# Altium project V1_motor driver.PrjPCB
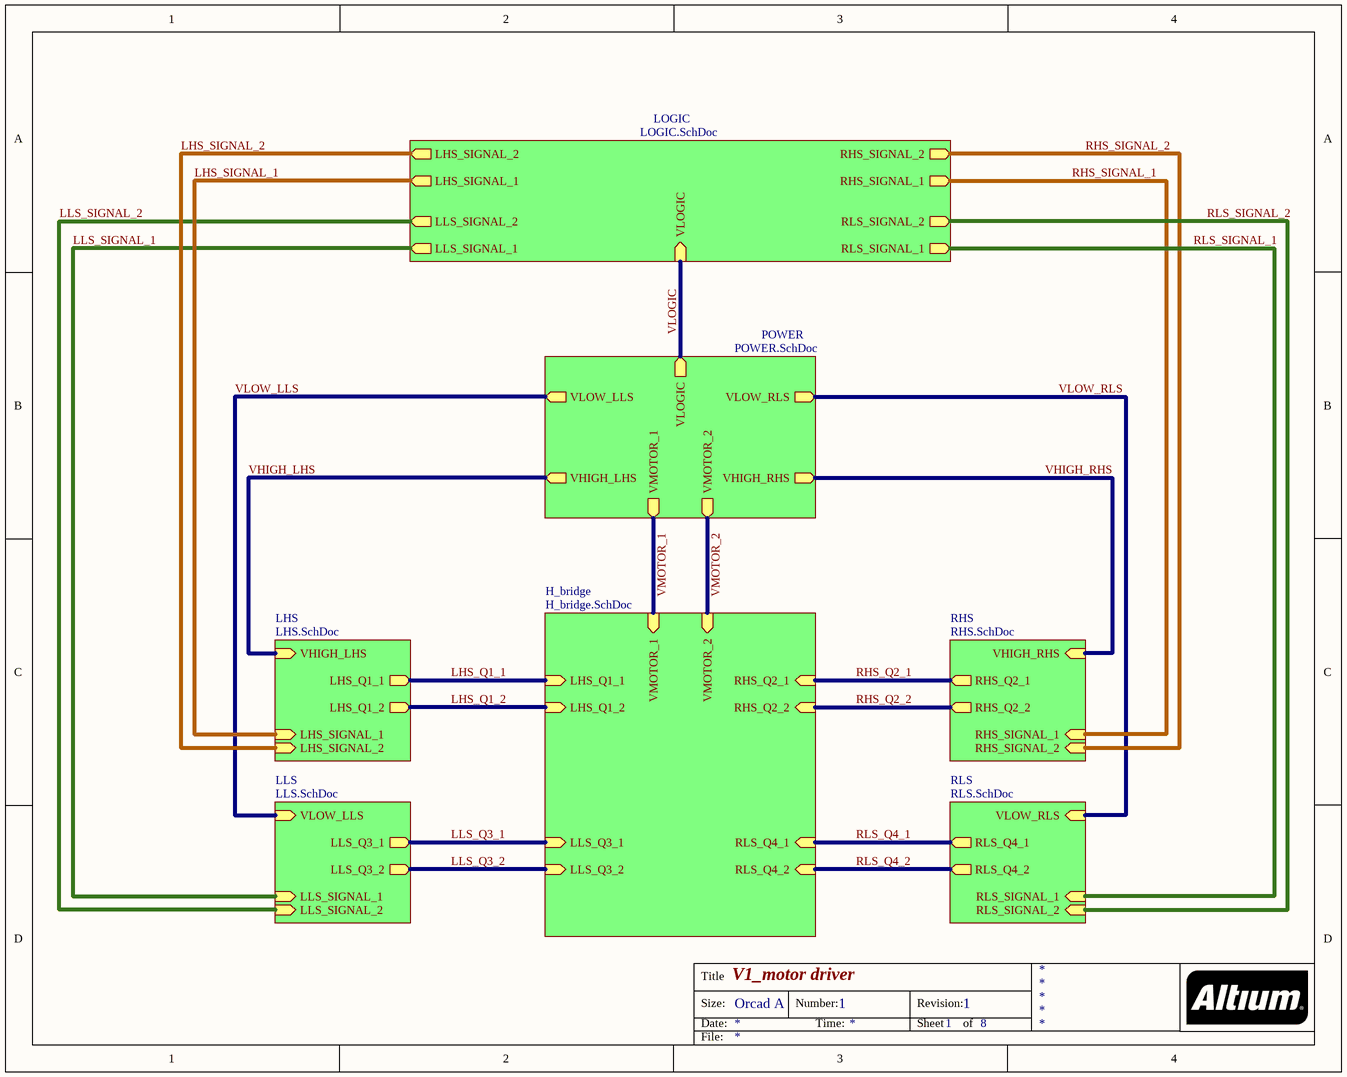
[diagram p0: Main_Sheet.SchDoc]
8 sheets, 120 parts. Net scope: hierarchical (ports join the sheet entries above them; power ports are global).
Board file: V1_motor driver.PcbDoc
Sheets:
  Main_Sheet.SchDoc
    H_bridge = H_bridge.SchDoc
    LHS = LHS.SchDoc
    LLS = LLS.SchDoc
    RHS = RHS.SchDoc
    RLS = RLS.SchDoc
    POWER = POWER.SchDoc
    LOGIC = LOGIC.SchDoc

## Sheet Main_Sheet.SchDoc: V1_motor driver
size OrCAD A; ApprovedBy: Abbas Mahmoud; CheckedBy: Abbas Mahmoud; Author: Abbas Mahmoud; CompanyName: lsa 4wya :); DrawnBy: Abbas Mahmoud; Engineer: Abbas Mahmoud; DocumentNumber: 1; Revision: 1; SheetNumber: 1; SheetTotal: 8

### Sub-sheets
H_bridge = H_bridge.SchDoc: VMOTOR_1 (in), LHS_Q1_1 (in), LLS_Q3_1 (in), RLS_Q4_1 (in), RHS_Q2_1 (in), RHS_Q2_2 (in), RLS_Q4_2 (in), LLS_Q3_2 (in), LHS_Q1_2 (in), VMOTOR_2 (in)
LHS = LHS.SchDoc: LHS_Q1_1 (out), VHIGH_LHS (in), LHS_SIGNAL_1 (in), LHS_Q1_2 (out), LHS_SIGNAL_2 (in)
LLS = LLS.SchDoc: LLS_Q3_1 (out), VLOW_LLS (in), LLS_SIGNAL_1 (in), LLS_Q3_2 (out), LLS_SIGNAL_2 (in)
LOGIC = LOGIC.SchDoc: VLOGIC (in), RHS_SIGNAL_1 (out), RHS_SIGNAL_2 (out), RLS_SIGNAL_1 (out), RLS_SIGNAL_2 (out), LHS_SIGNAL_1 (out), LHS_SIGNAL_2 (out), LLS_SIGNAL_1 (out), LLS_SIGNAL_2 (out)
POWER = POWER.SchDoc: VMOTOR_1 (out), VHIGH_LHS (out), VLOW_LLS (out), VHIGH_RHS (out), VLOW_RLS (out), VLOGIC (out), VMOTOR_2 (out)
RHS = RHS.SchDoc: RHS_Q2_1 (out), RHS_SIGNAL_1 (in), VHIGH_RHS (in), RHS_Q2_2 (out), RHS_SIGNAL_2 (in)
RLS = RLS.SchDoc: RLS_Q4_1 (out), RLS_SIGNAL_1 (in), VLOW_RLS (in), RLS_Q4_2 (out), RLS_SIGNAL_2 (in)

### Nets
VHIGH_LHS: sheet LHS/VHIGH_LHS, sheet RHS/VHIGH_RHS, sheet POWER/VHIGH_LHS, sheet POWER/VHIGH_RHS  [also labelled VHIGH_RHS]
VLOGIC: sheet POWER/VLOGIC, sheet LOGIC/VLOGIC
VLOW_LLS: sheet LLS/VLOW_LLS, sheet RLS/VLOW_RLS, sheet POWER/VLOW_LLS, sheet POWER/VLOW_RLS  [also labelled VLOW_RLS]
VMOTOR_1: sheet H_bridge/VMOTOR_1, sheet H_bridge/VMOTOR_2, sheet POWER/VMOTOR_1, sheet POWER/VMOTOR_2  [also labelled VMOTOR_2]
LHS_Q1_1: sheet H_bridge/LHS_Q1_1, sheet LHS/LHS_Q1_1
LHS_Q1_2: sheet H_bridge/LHS_Q1_2, sheet LHS/LHS_Q1_2
LHS_SIGNAL_1: sheet LHS/LHS_SIGNAL_1, sheet RLS/RLS_SIGNAL_1, sheet LOGIC/RLS_SIGNAL_1, sheet LOGIC/LHS_SIGNAL_1  [also labelled RLS_SIGNAL_1]  [project net A_D2]
LHS_SIGNAL_2: sheet LHS/LHS_SIGNAL_2, sheet RLS/RLS_SIGNAL_2, sheet LOGIC/RLS_SIGNAL_2, sheet LOGIC/LHS_SIGNAL_2  [also labelled RLS_SIGNAL_2]  [project net B_D2]
LLS_Q3_1: sheet H_bridge/LLS_Q3_1, sheet LLS/LLS_Q3_1
LLS_Q3_2: sheet H_bridge/LLS_Q3_2, sheet LLS/LLS_Q3_2
LLS_SIGNAL_1: sheet LLS/LLS_SIGNAL_1, sheet RHS/RHS_SIGNAL_1, sheet LOGIC/RHS_SIGNAL_1, sheet LOGIC/LLS_SIGNAL_1  [also labelled RHS_SIGNAL_1]  [project net A_D1]
LLS_SIGNAL_2: sheet LLS/LLS_SIGNAL_2, sheet RHS/RHS_SIGNAL_2, sheet LOGIC/RHS_SIGNAL_2, sheet LOGIC/LLS_SIGNAL_2  [also labelled RHS_SIGNAL_2]  [project net B_D1]
RHS_Q2_1: sheet H_bridge/RHS_Q2_1, sheet RHS/RHS_Q2_1
RHS_Q2_2: sheet H_bridge/RHS_Q2_2, sheet RHS/RHS_Q2_2
RLS_Q4_1: sheet H_bridge/RLS_Q4_1, sheet RLS/RLS_Q4_1
RLS_Q4_2: sheet H_bridge/RLS_Q4_2, sheet RLS/RLS_Q4_2

### Notes on the sheet
- Title
- Size:
- Date:
- Orcad A
- Number:
- Time:
- Revision:
- Sheet
- of
- File:

## Sheet H_bridge.SchDoc: H_bridge
size OrCAD A; ApprovedBy: Abbsa Mahmoud; CheckedBy: Abbas mahmoud; Author: Abbas Mahmoud; CompanyName: lsa 4wya :); DrawnBy: Abbas Mahmoud; Engineer: Abbas Mahmoud; DocumentNumber: 2; SheetNumber: 2; SheetTotal: 8
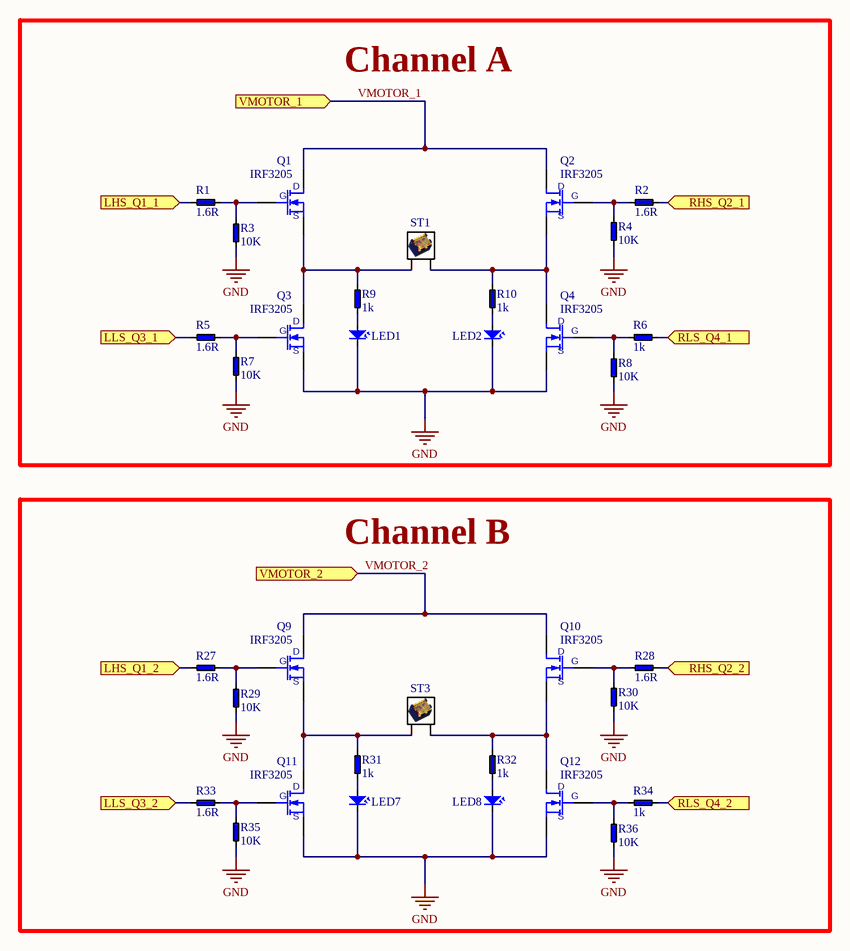
[diagram p1: H_bridge.SchDoc]

### Parts
LED1  LED  [LED 3MM BLUE]  (value not drawn)
LED2  LED  [LED 3MM BLUE]  (value not drawn)
LED7  LED  [LED 3MM BLUE]  (value not drawn)
LED8  LED  [LED 3MM BLUE]  (value not drawn)
Q1  IRF3205  [Transistor - duplicate2]
Q2  IRF3205  [Transistor - duplicate2]
Q3  IRF3205  [Transistor - duplicate2]
Q4  IRF3205  [Transistor - duplicate2]
Q9  IRF3205  [Transistor - duplicate2]
Q10  IRF3205  [Transistor - duplicate2]
Q11  IRF3205  [Transistor - duplicate2]
Q12  IRF3205  [Transistor - duplicate2]
R1  1.6R  [RESISTOR _9]
R2  1.6R  [RESISTOR _9]
R3  10K  [RESISTOR _9]
R4  10K  [RESISTOR _9]
R5  1.6R  [RESISTOR _9]
R6  1k  [RESISTOR _9]
R7  10K  [RESISTOR _9]
R8  10K  [RESISTOR _9]
R9  1k  [RESISTOR _9]
R10  1k  [RESISTOR _9]
R27  1.6R  [RESISTOR _9]
R28  1.6R  [RESISTOR _9]
R29  10K  [RESISTOR _9]
R30  10K  [RESISTOR _9]
R31  1k  [RESISTOR _9]
R32  1k  [RESISTOR _9]
R33  1.6R  [RESISTOR _9]
R34  1k  [RESISTOR _9]
R35  10K  [RESISTOR _9]
R36  10K  [RESISTOR _9]
ST1  SCREW TERMINAL  [SCREW TERMINAL]  (value not drawn)
ST3  SCREW TERMINAL  [SCREW TERMINAL]  (value not drawn)

### Blocks framed on the sheet
Channel A: LED1 LED2 Q1-Q4 R1-R10 ST1
Channel B: LED7 LED8 Q9-Q12 R27-R36 ST3

### Ports
LHS_Q1_1 (in), LHS_Q1_2 (in), LLS_Q3_1 (in), LLS_Q3_2 (in), RHS_Q2_1 (in), RHS_Q2_2 (in), RLS_Q4_1 (in), RLS_Q4_2 (in), VMOTOR_1 (in), VMOTOR_2 (in)

### Nets
GND: LED1.K LED2.K LED7.K LED8.K Q3.3(S) Q4.3(S) Q11.3(S) Q12.3(S) R3.1 R4.1 R7.1 R8.1 R29.1 R30.1 R35.1 R36.1
VMOTOR_1: Q1.2(D) Q2.2(D) Q9.2(D) Q10.2(D) ; port VMOTOR_1, port VMOTOR_2  [also labelled VMOTOR_2]
LHS_Q1_1: R1.1 ; port LHS_Q1_1
LHS_Q1_2: R27.1 ; port LHS_Q1_2
LLS_Q3_1: R5.1 ; port LLS_Q3_1
LLS_Q3_2: R33.1 ; port LLS_Q3_2
RHS_Q2_1: R2.2 ; port RHS_Q2_1
RHS_Q2_2: R28.2 ; port RHS_Q2_2
RLS_Q4_1: R6.2 ; port RLS_Q4_1
RLS_Q4_2: R34.2 ; port RLS_Q4_2
NetLED1_A: LED1.A R9.1
NetLED2_A: LED2.A R10.1
NetLED7_A: LED7.A R31.1
NetLED8_A: LED8.A R32.1
NetQ1_1: Q1.1(G) R1.2 R3.2
NetQ1_3: Q1.3(S) Q3.2(D) R9.2 ST1.1(AC)
NetQ2_1: Q2.1(G) R2.1 R4.2
NetQ2_3: Q2.3(S) Q4.2(D) R10.2 ST1.2(AC)
NetQ3_1: Q3.1(G) R5.2 R7.2
NetQ4_1: Q4.1(G) R6.1 R8.2
NetQ9_1: Q9.1(G) R27.2 R29.2
NetQ9_3: Q9.3(S) Q11.2(D) R31.2 ST3.1(AC)
NetQ10_1: Q10.1(G) R28.1 R30.2
NetQ10_3: Q10.3(S) Q12.2(D) R32.2 ST3.2(AC)
NetQ11_1: Q11.1(G) R33.2 R35.2
NetQ12_1: Q12.1(G) R34.1 R36.2

### Notes on the sheet
- Title
- Size:
- Date:
- Orcad A
- Number:
- Time:
- Revision:
- Sheet
- of
- File:

### Library data of the parts
Q1-Q4 Q9-Q12 = MOSFET-N: N CHANNEL MOSFET
R1-R10 R27-R36 = RESISTOR
ST1 ST3 = SCREW TERMINAL: Barrier Terminal Block 2 Pin with cover 300V/25A

## Sheet LHS.SchDoc: LHS
size OrCAD A; ApprovedBy: Abbas Mahmoud; CheckedBy: Abbas Mahmoud; Author: Abbas Mahmoud; CompanyName: lsa 4wya :); DrawnBy: Abbas Mahmoud; Engineer: Abbas Mahmoud; DocumentNumber: 7; Revision: 1; SheetNumber: 7; SheetTotal: 8
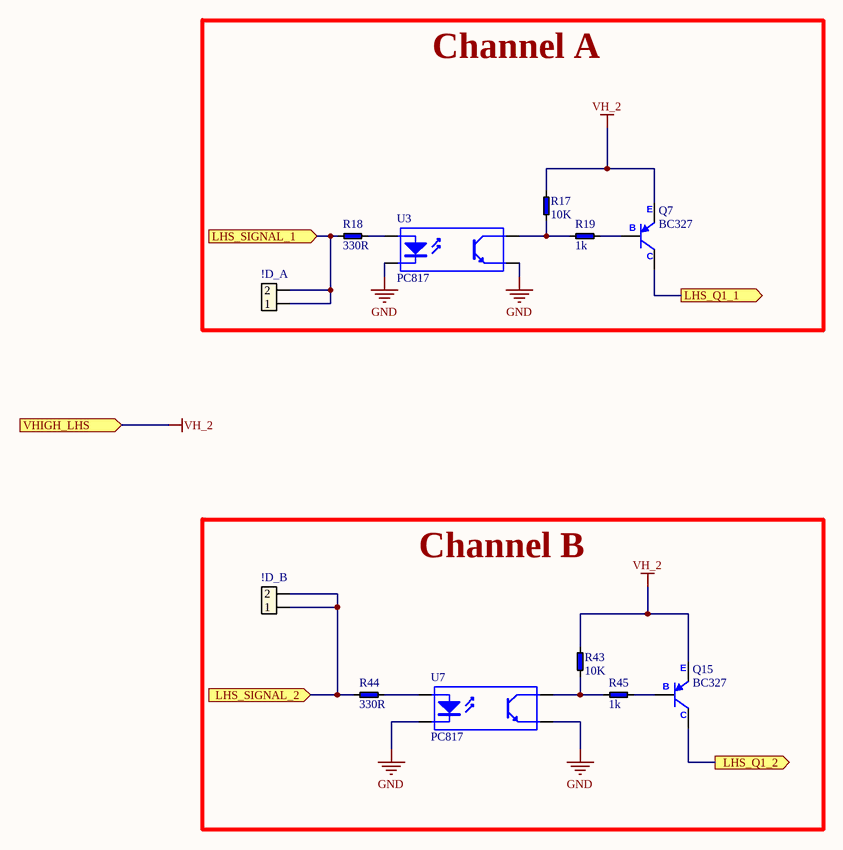
[diagram p2: LHS.SchDoc]

### Parts
!D_A  Header 2  [PINHEADER X2]  (value not drawn)
!D_B  Header 2  [PINHEADER X2]  (value not drawn)
Q7  BC327  [Transistor - duplicate3]
Q15  BC327  [Transistor - duplicate3]
R17  10K  [RESISTOR _9]
R18  330R  [RESISTOR _9]
R19  1k  [RESISTOR _9]
R43  10K  [RESISTOR _9]
R44  330R  [RESISTOR _9]
R45  1k  [RESISTOR _9]
U3  PC817  [IC X4 PIN]
U7  PC817  [IC X4 PIN]

### Blocks framed on the sheet
Channel A: !D_A Q7 R17-R19 U3
Channel B: !D_B Q15 R43-R45 U7

### Ports
LHS_Q1_1 (out), LHS_Q1_2 (out), LHS_SIGNAL_1 (in), LHS_SIGNAL_2 (in), VHIGH_LHS (in)

### Nets
GND: U3.2(K) U3.3(E) U7.2(K) U7.3(E)
VH_2: Q7.1(E) Q15.1(E) R17.1 R43.2 ; port VHIGH_LHS  [project net VHIGH_LHS]
A_D2: !D_A.1 !D_A.2 R18.1 ; port LHS_SIGNAL_1
B_D2: !D_B.1 !D_B.2 R44.1 ; port LHS_SIGNAL_2
LHS_Q1_1: Q7.3(C) ; port LHS_Q1_1
LHS_Q1_2: Q15.3(C) ; port LHS_Q1_2
NetQ7_2: Q7.2(B) R19.2
NetQ15_2: Q15.2(B) R45.2
NetR17_2: R17.2 R19.1 U3.4(C)
NetR18_2: R18.2 U3.1(A)
NetR43_1: R43.1 R45.1 U7.4(C)
NetR44_2: R44.2 U7.1(A)

### Notes on the sheet
- Title
- Size:
- Date:
- Orcad A
- Number:
- Time:
- Revision:
- Sheet
- of
- File:

### Library data of the parts
!D_A !D_B = Header 2: Header, 2-Pin; LatestRevisionDate: 17-Jul-2002; LatestRevisionNote: Re-released for DXP Platform.; Publisher: Altium Limited
Q7 Q15 = PNP
R17-R19 R43-R45 = RESISTOR
U3 U7 = Opto-coupler: 4-Pin Phototransistor Optocoupler; Published: 24-Mar-1999; LatestRevisionDate: 04-Mar-2005; LatestRevisionNote: Sch pins 3 & 4 Swapped.; DatasheetVersion: Nov-2003; PackageReference: DIP-4; Publisher: Altium Limited

## Sheet LLS.SchDoc: LLS
size OrCAD A; ApprovedBy: Abbas Mahmoud; CheckedBy: Abbas Mahmoud; Author: Abbas Mahmoud; CompanyName: lsa 4wya :); DrawnBy: Abbas Mahmoud; Engineer: Abbas Mahmoud; DocumentNumber: 8; Revision: 1; SheetNumber: 8; SheetTotal: 8
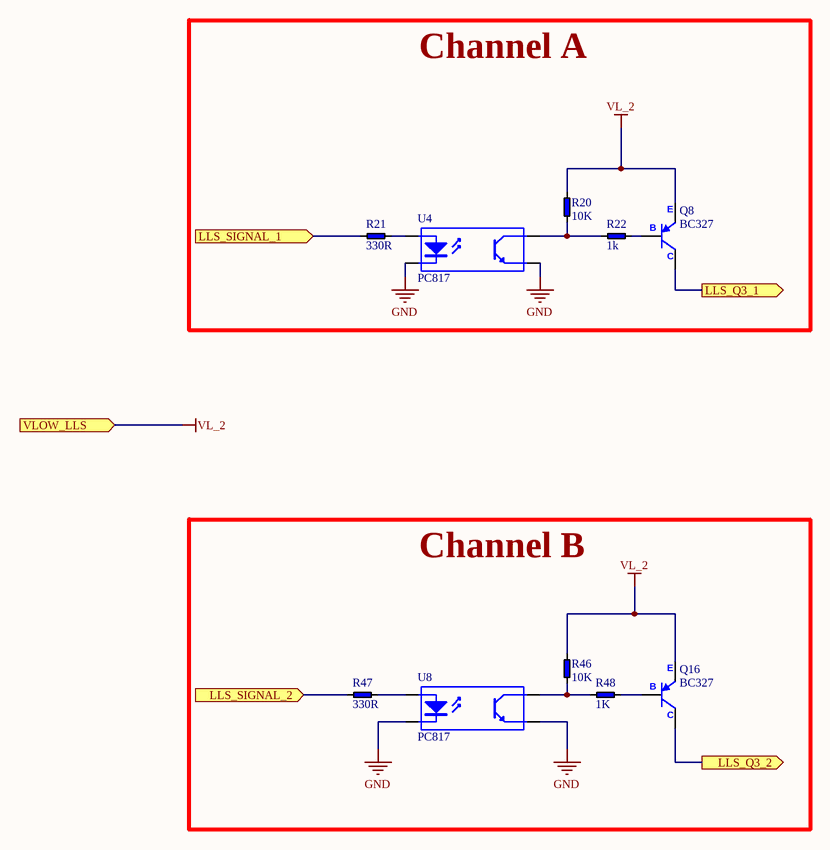
[diagram p3: LLS.SchDoc]

### Parts
Q8  BC327  [Transistor - duplicate3]
Q16  BC327  [Transistor - duplicate3]
R20  10K  [RESISTOR _9]
R21  330R  [RESISTOR _9]
R22  1k  [RESISTOR _9]
R46  10K  [RESISTOR _9]
R47  330R  [RESISTOR _9]
R48  1K  [RESISTOR _9]
U4  PC817  [IC X4 PIN]
U8  PC817  [IC X4 PIN]

### Blocks framed on the sheet
Channel A: Q8 R20-R22 U4
Channel B: Q16 R46-R48 U8

### Ports
LLS_Q3_1 (out), LLS_Q3_2 (out), LLS_SIGNAL_1 (in), LLS_SIGNAL_2 (in), VLOW_LLS (in)

### Nets
GND: U4.2(K) U4.3(E) U8.2(K) U8.3(E)
VL_2: Q8.1(E) Q16.1(E) R20.2 R46.2 ; port VLOW_LLS  [project net VLOW_LLS]
A_D1: R21.1 ; port LLS_SIGNAL_1
B_D1: R47.1 ; port LLS_SIGNAL_2
LLS_Q3_1: Q8.3(C) ; port LLS_Q3_1
LLS_Q3_2: Q16.3(C) ; port LLS_Q3_2
NetQ8_2: Q8.2(B) R22.2
NetQ16_2: Q16.2(B) R48.2
NetR20_1: R20.1 R22.1 U4.4(C)
NetR21_2: R21.2 U4.1(A)
NetR46_1: R46.1 R48.1 U8.4(C)
NetR47_2: R47.2 U8.1(A)

### Notes on the sheet
- Title
- Size:
- Date:
- Orcad A
- Number:
- Time:
- Revision:
- Sheet
- of
- File:

### Library data of the parts
Q8 Q16 = PNP
R20-R22 R46-R48 = RESISTOR
U4 U8 = Opto-coupler: 4-Pin Phototransistor Optocoupler; Published: 24-Mar-1999; LatestRevisionDate: 04-Mar-2005; LatestRevisionNote: Sch pins 3 & 4 Swapped.; DatasheetVersion: Nov-2003; PackageReference: DIP-4; Publisher: Altium Limited

## Sheet RHS.SchDoc: RHS
size OrCAD A; ApprovedBy: Abbas Mahmoud; CheckedBy: Abbas Mahmoud; Author: Abbas Mahmoud; CompanyName: lsa 4wya :); DrawnBy: Abbas Mahmoud; Engineer: Abbas Mahmoud; DocumentNumber: 5; Revision: 1; SheetNumber: 5; SheetTotal: 8
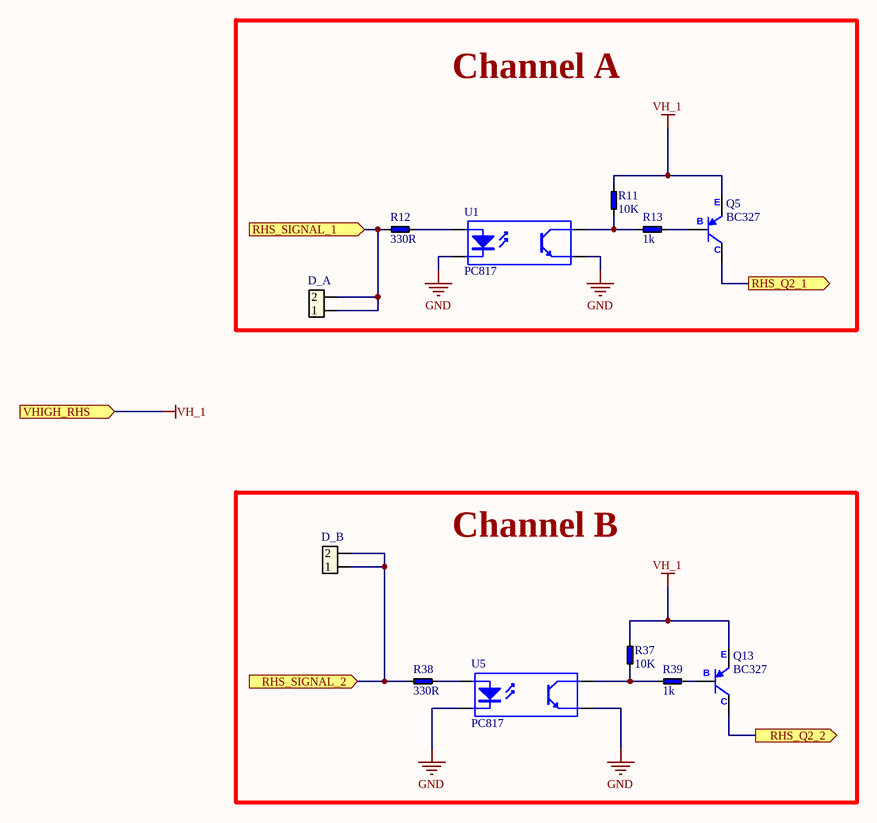
[diagram p4: RHS.SchDoc]

### Parts
D_A  Header 2  [PINHEADER X2]  (value not drawn)
D_B  Header 2  [PINHEADER X2]  (value not drawn)
Q5  BC327  [Transistor - duplicate3]
Q13  BC327  [Transistor - duplicate3]
R11  10K  [RESISTOR _9]
R12  330R  [RESISTOR _9]
R13  1k  [RESISTOR _9]
R37  10K  [RESISTOR _9]
R38  330R  [RESISTOR _9]
R39  1k  [RESISTOR _9]
U1  PC817  [IC X4 PIN]
U5  PC817  [IC X4 PIN]

### Blocks framed on the sheet
Channel A: D_A Q5 R11-R13 U1
Channel B: D_B Q13 R37-R39 U5

### Ports
RHS_Q2_1 (out), RHS_Q2_2 (out), RHS_SIGNAL_1 (in), RHS_SIGNAL_2 (in), VHIGH_RHS (in)

### Nets
GND: U1.2(K) U1.3(E) U5.2(K) U5.3(E)
VH_1: Q5.1(E) Q13.1(E) R11.2 R37.2 ; port VHIGH_RHS  [project net VHIGH_LHS]
A_D1: D_A.1 D_A.2 R12.1 ; port RHS_SIGNAL_1
B_D1: D_B.1 D_B.2 R38.1 ; port RHS_SIGNAL_2
RHS_Q2_1: Q5.3(C) ; port RHS_Q2_1
RHS_Q2_2: Q13.3(C) ; port RHS_Q2_2
NetQ5_2: Q5.2(B) R13.2
NetQ13_2: Q13.2(B) R39.2
NetR11_1: R11.1 R13.1 U1.4(C)
NetR12_2: R12.2 U1.1(A)
NetR37_1: R37.1 R39.1 U5.4(C)
NetR38_2: R38.2 U5.1(A)

### Notes on the sheet
- Title
- Size:
- Date:
- Orcad A
- Number:
- Time:
- Revision:
- Sheet
- of
- File:

### Library data of the parts
D_A D_B = Header 2: Header, 2-Pin; LatestRevisionDate: 17-Jul-2002; LatestRevisionNote: Re-released for DXP Platform.; Publisher: Altium Limited
Q5 Q13 = PNP
R11-R13 R37-R39 = RESISTOR
U1 U5 = Opto-coupler: 4-Pin Phototransistor Optocoupler; Published: 24-Mar-1999; LatestRevisionDate: 04-Mar-2005; LatestRevisionNote: Sch pins 3 & 4 Swapped.; DatasheetVersion: Nov-2003; PackageReference: DIP-4; Publisher: Altium Limited

## Sheet RLS.SchDoc: RLS
size OrCAD A; ApprovedBy: Abbas Mahmoud; CheckedBy: Abbas Mahmoud; Author: Abbas Mahmoud; CompanyName: lsa 4wya :); DrawnBy: Abbas Mahmoud; Engineer: Abbas Mahmoud; DocumentNumber: 6; Revision: 1; SheetNumber: 6; SheetTotal: 8
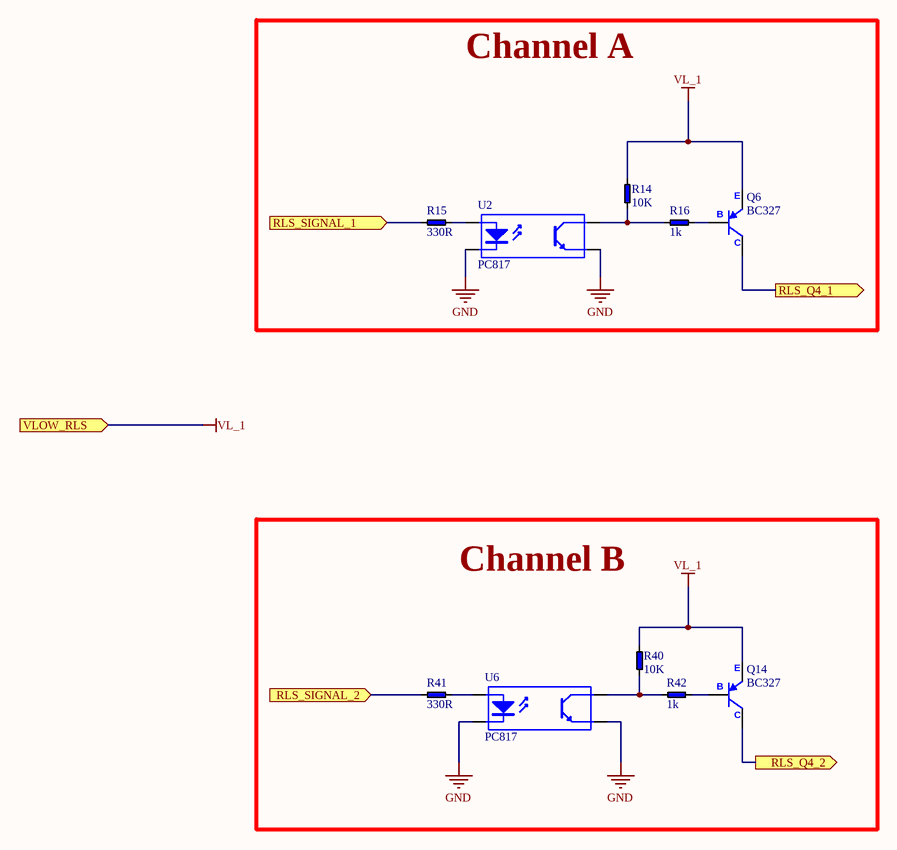
[diagram p5: RLS.SchDoc]

### Parts
Q6  BC327  [Transistor - duplicate3]
Q14  BC327  [Transistor - duplicate3]
R14  10K  [RESISTOR _9]
R15  330R  [RESISTOR _9]
R16  1k  [RESISTOR _9]
R40  10K  [RESISTOR _9]
R41  330R  [RESISTOR _9]
R42  1k  [RESISTOR _9]
U2  PC817  [IC X4 PIN]
U6  PC817  [IC X4 PIN]

### Blocks framed on the sheet
Channel A: Q6 R14-R16 U2
Channel B: Q14 R40-R42 U6

### Ports
RLS_Q4_1 (out), RLS_Q4_2 (out), RLS_SIGNAL_1 (in), RLS_SIGNAL_2 (in), VLOW_RLS (in)

### Nets
GND: U2.2(K) U2.3(E) U6.2(K) U6.3(E)
VL_1: Q6.1(E) Q14.1(E) R14.2 R40.2 ; port VLOW_RLS  [project net VLOW_LLS]
A_D2: R15.1 ; port RLS_SIGNAL_1
B_D2: R41.1 ; port RLS_SIGNAL_2
RLS_Q4_1: Q6.3(C) ; port RLS_Q4_1
RLS_Q4_2: Q14.3(C) ; port RLS_Q4_2
NetQ6_2: Q6.2(B) R16.2
NetQ14_2: Q14.2(B) R42.2
NetR14_1: R14.1 R16.1 U2.4(C)
NetR15_2: R15.2 U2.1(A)
NetR40_1: R40.1 R42.1 U6.4(C)
NetR41_2: R41.2 U6.1(A)

### Notes on the sheet
- Title
- Size:
- Date:
- Orcad A
- Number:
- Time:
- Revision:
- Sheet
- of
- File:

### Library data of the parts
Q6 Q14 = PNP
R14-R16 R40-R42 = RESISTOR
U2 U6 = Opto-coupler: 4-Pin Phototransistor Optocoupler; Published: 24-Mar-1999; LatestRevisionDate: 04-Mar-2005; LatestRevisionNote: Sch pins 3 & 4 Swapped.; DatasheetVersion: Nov-2003; PackageReference: DIP-4; Publisher: Altium Limited

## Sheet POWER.SchDoc: POWER
size A; ApprovedBy: Abbas Mahmoud; CheckedBy: Abbas Mahmoud; Author: Abbas Mahmoud; CompanyName: lsa 4wya :); DrawnBy: Abbas Mahmoud; Engineer: Abbas Mahmoud; DocumentNumber: 3; Revision: 1; SheetNumber: 3; SheetTotal: 8
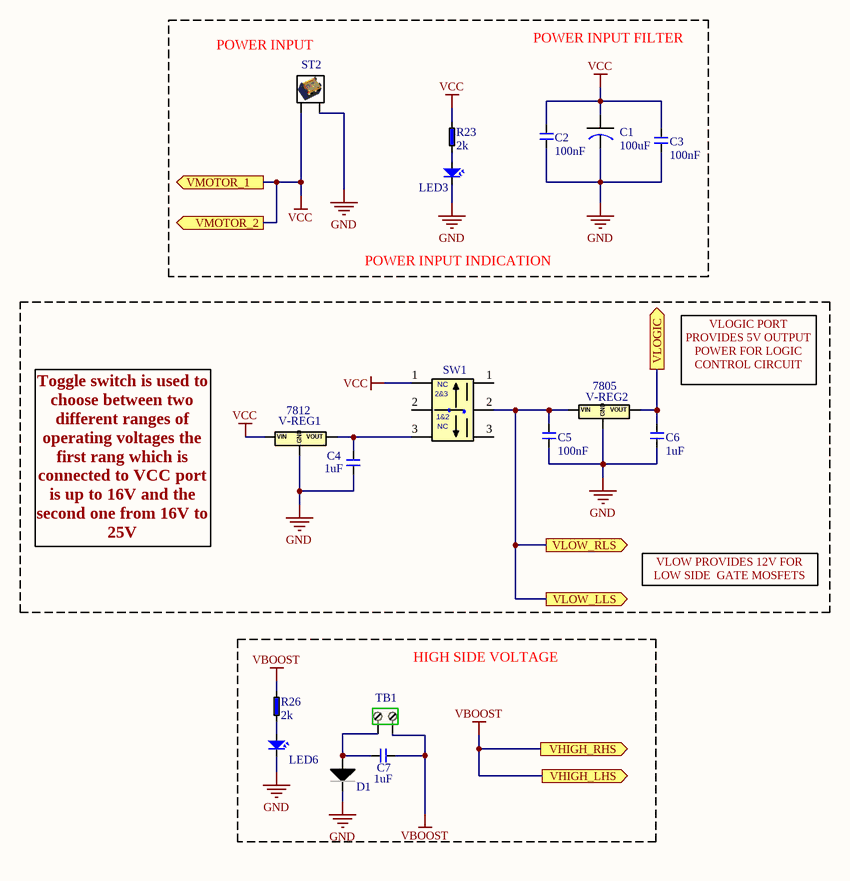
[diagram p6: POWER.SchDoc]

### Parts
C1  100uF  [ECAP 5X11X2MM]
C2  100nF  [CCAP 0.1 N Y]
C3  100nF  [CCAP 0.1 N Y]
C4  1uF  [CCAP 0.1 N Y]
C5  100nF  [CCAP 0.1 N Y]
C6  1uF  [CCAP 0.1 N Y]
C7  1uF  [CCAP 0.1 N Y]
D1  DIODE  [DIODE SMD]  (value not drawn)
LED3  LED  [LED 3MM GREEN]  (value not drawn)
LED6  LED  [LED 5MM GREEN]  (value not drawn)
R23  2k  [RESISTOR _9]
R26  2k  [RESISTOR _9]
ST2  SCREW TERMINAL  [SCREW TERMINAL]  (value not drawn)
SW1  Toggle Switch  [Toggle 3 pins]  (value not drawn)
TB1  Terminal block 2 pin  [AK500/2 - pluggable]  (value not drawn)
V-REG1  7812  [V-REG]
V-REG2  7805  [V-REG]

### Blocks framed on the sheet
HIGH SIDE VOLTAGE: C7 D1 LED6 R26 TB1

### Ports
VHIGH_LHS (out), VHIGH_RHS (out), VLOGIC (out), VLOW_LLS (out), VLOW_RLS (out), VMOTOR_1 (out), VMOTOR_2 (out)

### Nets
GND: C1.K C2.2 C3.2 C4.2 C5.2 C6.2 D1.K LED3.K LED6.K ST2.2(AC) V-REG1.2(GND) V-REG2.2(GND)
VBOOST: C7.2 R26.2 TB1.1 ; port VHIGH_RHS, port VHIGH_LHS  [project net VHIGH_LHS]
VCC: C1.A C2.1 C3.1 R23.2 ST2.1(AC) SW1.1 V-REG1.1(VIN) ; port VMOTOR_1, port VMOTOR_2  [project net VMOTOR_1]
VLOGIC: C6.1 V-REG2.3(VOUT) ; port VLOGIC
VLOW_LLS: C5.1 SW1.2 V-REG2.1(VIN) ; port VLOW_RLS, port VLOW_LLS
NetC4_1: C4.1 SW1.3 V-REG1.3(VOUT)
NetC7_1: C7.1 D1.A TB1.2
NetLED3_A: LED3.A R23.1
NetLED6_A: LED6.A R26.1

### Notes on the sheet
- (near ST2) POWER INPUT
- POWER INPUT FILTER
- POWER INPUT INDICATION
- VLOGIC PORT PROVIDES 5V OUTPUT POWER FOR LOGIC CONTROL CIRCUIT
- Toggle switch is used to choose between two different ranges of operating voltages the first rang which is connected to VCC port is up to 16V and the second one from 16V to 25V
- VLOW PROVIDES 12V FOR LOW SIDE  GATE MOSFETS
- Title
- Size:
- Date:
- A
- Number:
- Time:
- Revision:
- Sheet
- of
- File:
- (in symbol Toggle Switch) NC; 2&3; 1&2

### Library data of the parts
C1 = CAP POL
C2-C7 = CERAMIC CAP
R23 R26 = RESISTOR
ST2 = SCREW TERMINAL: as ST1 on sheet H_bridge
SW1 = Toggle Switch: Toggle Switch 3-Pin SPDT ON-ON 6A 125VAC
TB1 = Terminal block 2 pin: Terminal Block 2 Pin 10A 300V
V-REG1 V-REG2 = V-REG: 78xx Regulators

## Sheet LOGIC.SchDoc: LOGIC
size OrCAD A; ApprovedBy: Abbas Mahmoud; CheckedBy: Abbas Mahmoud; Author: Abbas Mahmoud; CompanyName: lsa 4wya :); DrawnBy: Abbas Mahmoud; Engineer: Abbas Mahmoud; DocumentNumber: 4; Revision: 1; SheetNumber: 4; SheetTotal: 8
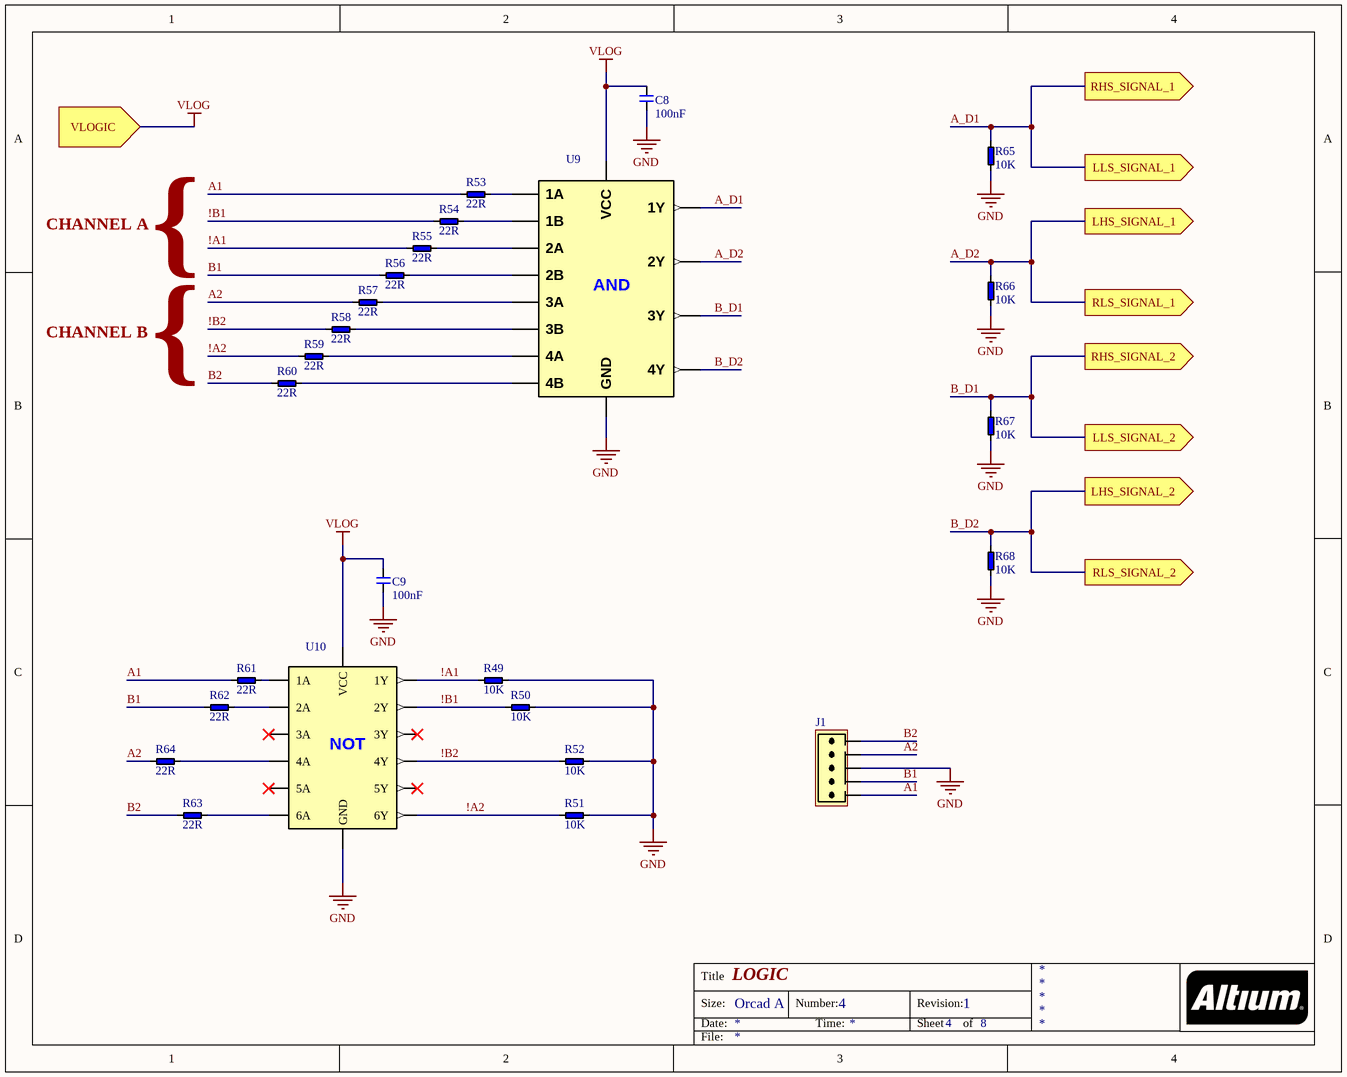
[diagram p7: LOGIC.SchDoc]

### Parts
C8  100nF  [CCAP 0.1 N Y]
C9  100nF  [CCAP 0.1 N Y]
J1  DATA CONNECTOR *5  [MOLEX *5_DATA CONNECTOR]  (value not drawn)
R49  10K  [RESISTOR _9]
R50  10K  [RESISTOR _9]
R51  10K  [RESISTOR _9]
R52  10K  [RESISTOR _9]
R53  22R  [RESISTOR _9]
R54  22R  [RESISTOR _9]
R55  22R  [RESISTOR _9]
R56  22R  [RESISTOR _9]
R57  22R  [RESISTOR _9]
R58  22R  [RESISTOR _9]
R59  22R  [RESISTOR _9]
R60  22R  [RESISTOR _9]
R61  22R  [RESISTOR _9]
R62  22R  [RESISTOR _9]
R63  22R  [RESISTOR _9]
R64  22R  [RESISTOR _9]
R65  10K  [RESISTOR _9]
R66  10K  [RESISTOR _9]
R67  10K  [RESISTOR _9]
R68  10K  [RESISTOR _9]
U9  SN74F08N  [IC X14 PIN]  (value not drawn)
U10  SN7404N  [IC X14 PIN]  (value not drawn)

### Ports
LHS_SIGNAL_1 (out), LHS_SIGNAL_2 (out), LLS_SIGNAL_1 (out), LLS_SIGNAL_2 (out), RHS_SIGNAL_1 (out), RHS_SIGNAL_2 (out), RLS_SIGNAL_1 (out), RLS_SIGNAL_2 (out), VLOGIC (in)

### Nets
GND: C8.2 C9.2 J1.3 R49.2 R50.2 R51.2 R52.2 R65.1 R66.1 R67.1 R68.1 U9.7(GND) U10.7(GND)
VLOG: C8.1 C9.1 U9.14(VCC) U10.14(VCC) ; port VLOGIC  [project net VLOGIC]
!A1: R49.1 R55.1 U10.2(1Y)
!A2: R51.1 R59.1 U10.12(6Y)
!B1: R50.1 R54.1 U10.4(2Y)
!B2: R52.1 R58.1 U10.8(4Y)
A1: J1.5 R53.1 R61.1
A2: J1.2 R57.1 R64.1
A_D1: R65.2 U9.3(1Y) ; port RHS_SIGNAL_1, port LLS_SIGNAL_1
A_D2: R66.2 U9.6(2Y) ; port LHS_SIGNAL_1, port RLS_SIGNAL_1
B1: J1.4 R56.1 R62.1
B2: J1.1 R60.1 R63.1
B_D1: R67.2 U9.8(3Y) ; port RHS_SIGNAL_2, port LLS_SIGNAL_2
B_D2: R68.2 U9.11(4Y) ; port LHS_SIGNAL_2, port RLS_SIGNAL_2
NetR53_2: R53.2 U9.1(1A)
NetR54_2: R54.2 U9.2(1B)
NetR55_2: R55.2 U9.4(2A)
NetR56_2: R56.2 U9.5(2B)
NetR57_2: R57.2 U9.9(3A)
NetR58_2: R58.2 U9.10(3B)
NetR59_2: R59.2 U9.12(4A)
NetR60_2: R60.2 U9.13(4B)
NetR61_2: R61.2 U10.1(1A)
NetR62_2: R62.2 U10.3(2A)
NetR63_2: R63.2 U10.13(6A)
NetR64_2: R64.2 U10.9(4A)

Not connected (* = marked no-connect by the designer): U10 5(3A)* 6(3Y)* 10(5Y)* 11(5A)*

### Notes on the sheet
- CHANNEL A
- {
- CHANNEL B
- Title
- Size:
- Date:
- Orcad A
- Number:
- Time:
- Revision:
- Sheet
- of
- File:
- (in symbol 7404  (NOT)) NOT
- (in symbol 7408  (AND)) AND

### Library data of the parts
C8 C9 = CERAMIC CAP
J1 = DATA CONNECTOR *5: Data Cable JST 5-pin
R49-R68 = RESISTOR
U9 = 7408  (AND): AND Gate 4-Element 2-IN Bipolar 14-Pin PDIP AND Gate 4-Element 2-IN Bipolar 14-Pin PDIP; MF: Texas Instruments; MP: SN74F08N; Price: 0.36 USD; SnapEDA_Link: https://www.snapeda.com/parts/SN74F08N/Texas%20Instruments/view-part/?ref=snap; Package: DIP-14 Texas Instruments; Availability: Good; Value: *
U10 = 7404  (NOT): Inverter 6-Element Bipolar 14-Pin PDIP Tube; MF: Texas Instruments; Price: 1.26 USD; SnapEDA_Link: https://www.snapeda.com/parts/SN7404N/Texas%20Instruments/view-part/?ref=snap; MP: SN7404N; Availability: Good; Package: DIP-14 Texas Instruments; Value: *

## Nets that join several sheets
GND: H_bridge (16 pins), LHS (U3.2 U3.3 U7.2 U7.3), LLS (U4.2 U4.3 U8.2 U8.3), RHS (U1.2 U1.3 U5.2 U5.3), RLS (U2.2 U2.3 U6.2 U6.3), POWER (12 pins), LOGIC (13 pins)
VHIGH_LHS: LHS (Q7.1 Q15.1 R17.1 R43.2), RHS (Q5.1 Q13.1 R11.2 R37.2), POWER (C7.2 R26.2 TB1.1)
VLOGIC: POWER (C6.1 V-REG2.3), LOGIC (C8.1 C9.1 U9.14 U10.14)
VLOW_LLS: LLS (Q8.1 Q16.1 R20.2 R46.2), RLS (Q6.1 Q14.1 R14.2 R40.2), POWER (C5.1 SW1.2 V-REG2.1)
VMOTOR_1: H_bridge (Q1.2 Q2.2 Q9.2 Q10.2), POWER (7 pins)
A_D1: LLS (R21.1), RHS (D_A.1 D_A.2 R12.1), LOGIC (R65.2 U9.3)
A_D2: LHS (!D_A.1 !D_A.2 R18.1), RLS (R15.1), LOGIC (R66.2 U9.6)
B_D1: LLS (R47.1), RHS (D_B.1 D_B.2 R38.1), LOGIC (R67.2 U9.8)
B_D2: LHS (!D_B.1 !D_B.2 R44.1), RLS (R41.1), LOGIC (R68.2 U9.11)
LHS_Q1_1: H_bridge (R1.1), LHS (Q7.3)
LHS_Q1_2: H_bridge (R27.1), LHS (Q15.3)
LLS_Q3_1: H_bridge (R5.1), LLS (Q8.3)
LLS_Q3_2: H_bridge (R33.1), LLS (Q16.3)
RHS_Q2_1: H_bridge (R2.2), RHS (Q5.3)
RHS_Q2_2: H_bridge (R28.2), RHS (Q13.3)
RLS_Q4_1: H_bridge (R6.2), RLS (Q6.3)
RLS_Q4_2: H_bridge (R34.2), RLS (Q14.3)